# EAGLE design smartstickSTM32f103cb (EAGLE 6.5.0)
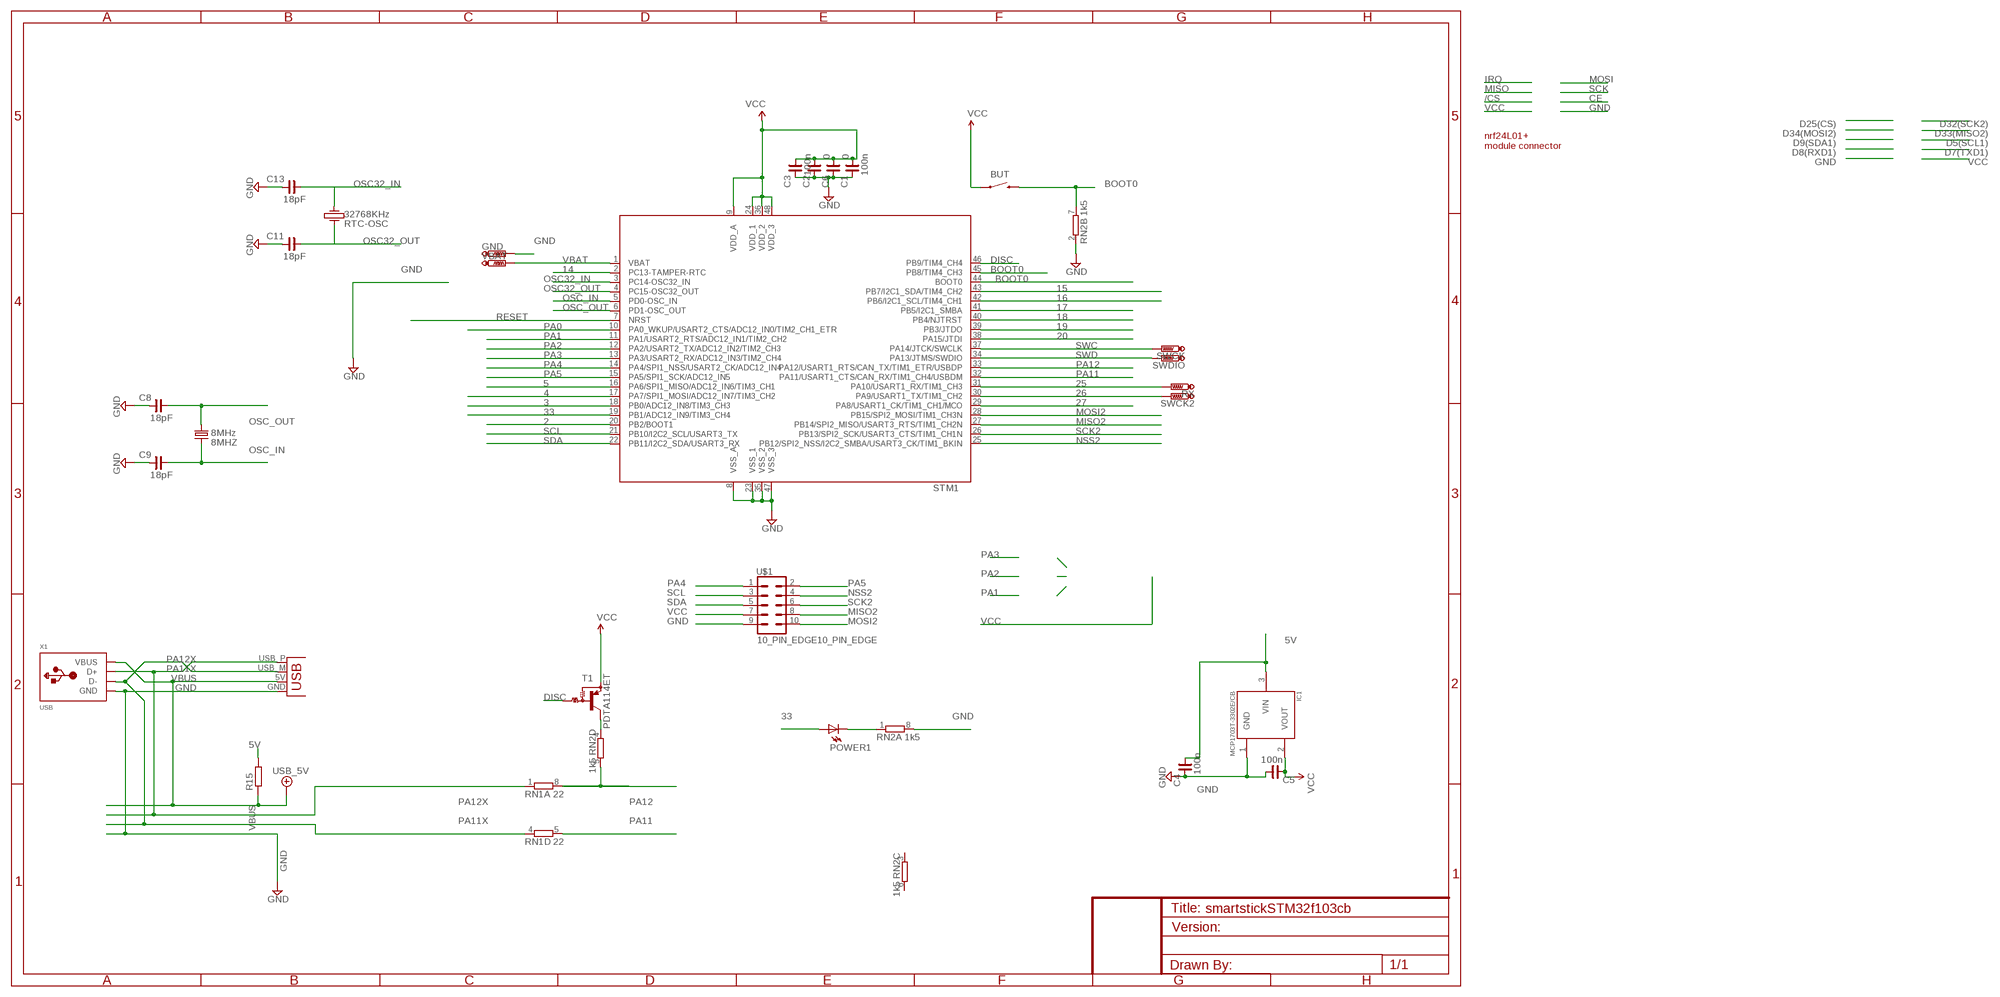
[diagram p0: schematic, sheet 1]

## Parts
8MHZ  8MHz  CRYSTALHC49US  [HC49US]
BUT  SWITCH-MOMENTARY-2-SMD-1101NE  [TACTILE-SWITCH-1101NE]
C1  100n  C_0603  [C0603]
C2  0  C_0603  [C0603]
C3  100n  C_0603  [C0603]
C4  100n  C_0603  [C0603]
C5  100n  C_0603  [C0603]
C6  0  C_0603  [C0603]
C8  18pF  C_0603  [C0603]
C9  18pF  C_0603  [C0603]
C11  18pF  C_0603  [C0603]
C13  18pF  C_0603  [C0603]
GND  PTR1TP20SQ  [TP20SQ]
IC1  MCP1703T-3302E/CB  MCP1700T  [SOT23]
POWER1  Power  LED0603  [LED-0603]
R15  R-EU_R0603  [R0603]
RN1  22  4R-N0603-ARC  [0603-ARC]
RN2  1k5  4R-N0603-ARC  [0603-ARC]
RTC-OSC  32768KHz  CRYSTALL  [KX-327LT]
RX  PTR1TP10R  [TP10R]
STM1  STM32F103CB  [LQFP48]
SWCK  PTR1TP16R  [TP16R]
SWCK2  PTR1TP10R  [TP10R]
SWDIO  PTR1TP16R  [TP16R]
T1  PDTA114ET  ES_PNP-DRIVERSOT23-3  [ES_SOT23-3]
U$1  10_PIN_EDGE10_PIN_EDGE  [10_PIN_EDGE]
VBAT  PTR1TP19R  [TP19R]
X1  USB  [MOLEX-48037-1000]
X3  USBPCB  [USB-A-PCB]

## Nets
2: STM1.20(PB2/BOOT1)
3: STM1.18(PB0/ADC12_IN8/TIM3_CH3)
4: STM1.17(PA7/SPI1_MOSI/ADC12_IN7/TIM3_CH2)
5: STM1.16(PA6/SPI1_MISO/ADC12_IN6/TIM3_CH1)
5V [vcc]: C4.1 IC1.3(VIN) R15.2
14: STM1.2(PC13-TAMPER-RTC)
15: STM1.43(PB7/I2C1_SDA/TIM4_CH2)
16: STM1.42(PB6/I2C1_SCL/TIM4_CH1)
17: STM1.41(PB5/I2C1_SMBA)
18: STM1.40(PB4/NJTRST)
19: STM1.39(PB3/JTDO)
20: STM1.38(PA15/JTDI)
25: RX.TP STM1.31(PA10/USART1_RX/TIM1_CH3)
26: STM1.30(PA9/USART1_TX/TIM1_CH2) SWCK2.TP
27: STM1.29(PA8/USART1_CK/TIM1_CH1/MCO)
33: POWER1.A STM1.19(PB1/ADC12_IN9/TIM3_CH4)
BOOT0: BUT.P$2 RN2.7 STM1.44(BOOT0) STM1.45(PB8/TIM4_CH3)
DISC: STM1.46(PB9/TIM4_CH4) T1.1(B)
GND [vcc]: C1.2 C2.2 C3.2 C4.2 C5.1 C6.2 C8.2 C9.2 C11.2 C13.2 GND.TP IC1.1(GND) RN2.2 RN2.8 STM1.8(VSS_A) STM1.23(VSS_1) STM1.35(VSS_2) STM1.47(VSS_3) U$1.9 X1.4(GND) X3.GND
MISO2: STM1.27(PB14/SPI2_MISO/USART3_RTS/TIM1_CH2N) U$1.8
MOSI2: STM1.28(PB15/SPI2_MOSI/TIM1_CH3N) U$1.10
N$5: POWER1.C RN2.1
N$51: RN2.4 T1.3(C)
NSS2: STM1.25(PB12/SPI2_NSS/I2C2_SMBA/USART3_CK/TIM1_BKIN) U$1.4
OSC32_IN: C13.1 RTC-OSC.1 STM1.3(PC14-OSC32_IN)
OSC32_OUT: C11.1 RTC-OSC.4 STM1.4(PC15-OSC32_OUT)
OSC_IN: 8MHZ.2 C9.1 STM1.5(PD0-OSC_IN)
OSC_OUT: 8MHZ.1 C8.1 STM1.6(PD1-OSC_OUT)
PA0: STM1.10(PA0_WKUP/USART2_CTS/ADC12_IN0/TIM2_CH1_ETR)
PA1: STM1.11(PA1/USART2_RTS/ADC12_IN1/TIM2_CH2)
PA2: STM1.12(PA2/USART2_TX/ADC12_IN2/TIM2_CH3)
PA3: STM1.13(PA3/USART2_RX/ADC12_IN3/TIM2_CH4)
PA4: STM1.14(PA4/SPI1_NSS/USART2_CK/ADC12_IN4) U$1.1
PA5: STM1.15(PA5/SPI1_SCK/ADC12_IN5) U$1.2
PA11: RN1.5 STM1.32(PA11/USART1_CTS/CAN_RX/TIM1_CH4/USBDM)
PA11X: RN1.4 X1.2(D-) X3.USB_M(D-)
PA12: RN1.8 RN2.5 STM1.33(PA12/USART1_RTS/CAN_TX/TIM1_ETR/USBDP)
PA12X: RN1.1 X1.3(D+) X3.USB_P(D+)
RESET: STM1.7(NRST)
SCK2: STM1.26(PB13/SPI2_SCK/USART3_CTS/TIM1_CH1N) U$1.6
SCL: STM1.21(PB10/I2C2_SCL/USART3_TX) U$1.3
SDA: STM1.22(PB11/I2C2_SDA/USART3_RX) U$1.5
SWC: STM1.37(PA14/JTCK/SWCLK) SWCK.TP
SWD: STM1.34(PA13/JTMS/SWDIO) SWDIO.TP
VBAT: STM1.1(VBAT) VBAT.TP
VBUS: R15.1 X1.1(VBUS) X3.5V(VBUS) ; supply symbol labelled USB_5V
VCC [vcc]: BUT.P$1 C1.1 C2.1 C3.1 C5.2 C6.1 IC1.2(VOUT) STM1.9(VDD_A) STM1.24(VDD_1) STM1.36(VDD_2) STM1.48(VDD_3) T1.2(E) U$1.7
Unconnected: RN1.2 RN1.3 RN1.6 RN1.7 RN2.3 RN2.6

## Notes on the sheet
- nrf24L01+ 
  module connector
- BOOT0

## Library data of the parts
8MHZ = SparkFun_20110922_my:CRYSTAL: Crystals Various standard crystals. Proven footprints. Spark Fun Electronics SKU : COM-00534
BUT = SparkFun:SWITCH-MOMENTARY-2
C1-C6 C8 C9 C11 C13 = rc-master-smd:C_: NON-POLARIZED CAP
GND RX SWCK SWCK2 SWDIO VBAT = testpad:PTR1: TEST PIN
IC1 = okie:MCP1700T
POWER1 = SparkFun:LED: LEDs Standard schematic elements and footprints for 5mm, 3mm, 1206, and 0603 sized LEDs. 5mm - Spark Fun Electronics SKU : COM-00529 (and others)
R15 = resistor:R-EU_: RESISTOR, European symbol
RN1 RN2 = resistor-dil:4R-N: Array Chip Resistor Source: RS Component / Phycomp; OC_FARNELL: unknown; OC_NEWARK: unknown
RTC-OSC = es:CRYSTALL
STM1 = stm32:STM32F103CB
T1 = pnp_digital_transistor:ES_PNP-DRIVER
U$1 = eclibrary:10_PIN_EDGE
X1 = todstuff:USB
X3 = SparkFun:USB: USB Connectors USB-B-PTH is fully proven SKU : PRT-00139 USB-miniB is fully proven SKU : PRT-00587 USB-A-PCB is untested. USB-A-H is throughly reviewed, but untested. Spark Fun Electronics SKU : PRT-00437 USB-B-SMT is throughly reviewed, but untested. Needs silkscreen touching up. USB-A-S has not been used/tested USB-MB-H has not been used/tested

## Net classes
0 default: width 0.152 mm, drill 0.356 mm, clearance 0.152 mm
1 vcc: width 0.152 mm, drill 0.356 mm, clearance 0.152 mm
2 pwr: width 0.152 mm, drill 0.356 mm, clearance 0.152 mm

## Board
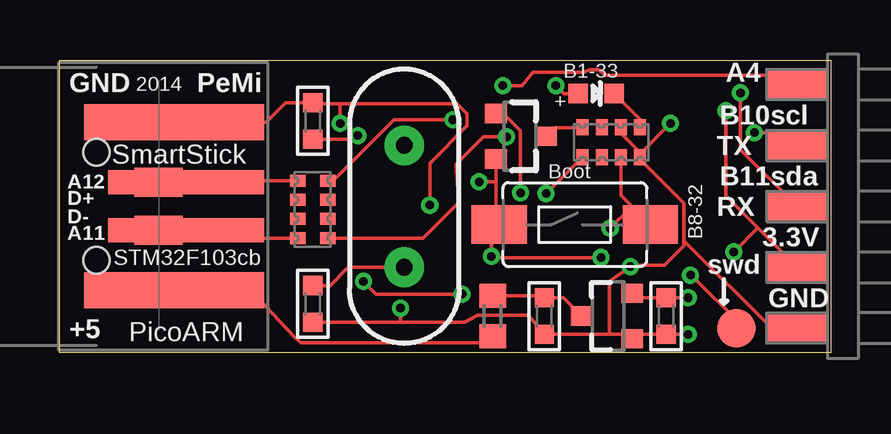
[diagram p1: board, top side]
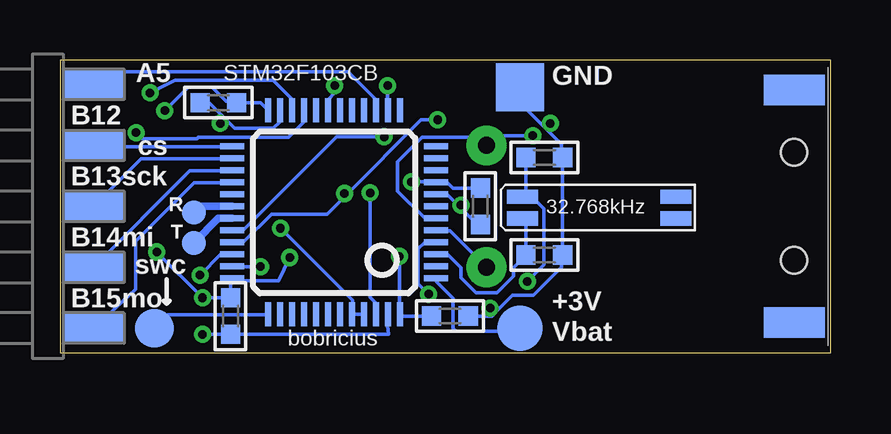
[diagram p2: board, bottom side, seen from below]

Size 32.13 x 12.19 mm. Coordinates in mm from the lower left corner, seen from the top.
Outline: 0,12.19 32.13,12.19 32.13,0 0,0 0,12.19
Copper layers (1*16): Top 0.0356mm / dielectric 1.5011mm / Bottom 0.0356mm
Design rules "LaenPCBOrder *": minimum track width 6mil, minimum drill 13mil, track to track 6mil, track to pad 6mil, pad to pad 6mil, via to via 6mil, smd to smd 6mil, copper to edge 15mil, drill to drill 6mil, minimum pad ring 7mil, minimum via ring 7mil, stop-mask expansion 3mil, vias tented up to drill 100mil, thermal gap 10mil
tRestrict: area 0.1,0.8 to 3.2,11.7
vRestrict: area 0.1,0.8 to 8,11.7

### Footprints (pad centres in the part's own frame; a part is rotated, then mirrored left to right if it is on the bottom)
HC49US = drill 0.7 pad 1.651: 1 -2.54,0; 2 2.54,0
TACTILE-SWITCH-1101NE = smd 2.3 x 1.6: P$1 -3.15,0; P$2 3.15,0
C0603 = smd 0.8 x 0.8: 1 -0.762,0; 2 0.762,0
TP20SQ = smd 2 x 2: TP 0,0
SOT23 = smd 0.8 x 0.9: 1 -0.95,-1; 2 0.95,-1; 3 0,1.1
LED-0603 = smd 0.8 x 0.8: A 0,-0.75; C 0,0.75
R0603 = smd 1 x 1.1: 1 -0.85,0; 2 0.85,0
0603-ARC = smd 0.5 x 0.65: 1 -1.2,-0.625; 2 -0.4,-0.625; 3 0.4,-0.625; 4 1.2,-0.625; 5 1.2,0.625; 6 0.4,0.625; 7 -0.4,0.625; 8 -1.2,0.625
KX-327LT = smd 1.3 x 0.6: 1 -3.2,-0.5; 2 3.2,-0.5; 3 3.2,0.4; 4 -3.2,0.4
TP10R = smd 1 x 1: TP 0,0
LQFP48 = smd 0.254 x 1: 1 -2.75,-4.25; 2 -2.25,-4.25; 3 -1.75,-4.25; 4 -1.25,-4.25; 5 -0.75,-4.25; 6 -0.25,-4.25; 7 0.25,-4.25; 8 0.75,-4.25; 9 1.25,-4.25; 10 1.75,-4.25; 11 2.25,-4.25; 12 2.75,-4.25; 25 2.75,4.25; 26 2.25,4.25; 27 1.75,4.25; 28 1.25,4.25; 29 0.75,4.25; 30 0.25,4.25; 31 -0.25,4.25; 32 -0.75,4.25; 33 -1.25,4.25; 34 -1.75,4.25; 35 -2.25,4.25; 36 -2.75,4.25 | smd 1 x 0.254: 13 4.25,-2.75; 14 4.25,-2.25; 15 4.25,-1.75; 16 4.25,-1.25; 17 4.25,-0.75; 18 4.25,-0.25; 19 4.25,0.25; 20 4.25,0.75; 21 4.25,1.25; 22 4.25,1.75; 23 4.25,2.25; 24 4.25,2.75; 37 -4.25,2.75; 38 -4.25,2.25; 39 -4.25,1.75; 40 -4.25,1.25; 41 -4.25,0.75; 42 -4.25,0.25; 43 -4.25,-0.25; 44 -4.25,-0.75; 45 -4.25,-1.25; 46 -4.25,-1.75; 47 -4.25,-2.25; 48 -4.25,-2.75
TP16R = smd 1.6 x 1.6: TP 0,0
ES_SOT23-3 = smd 0.8 x 0.9: 1 -0.95,-1; 2 0.95,-1; 3 0,1.1
10_PIN_EDGE = smd 1.27 x 2.54: 1 5.08,0; 3 2.54,0; 5 0,0; 7 -2.54,0; 9 -5.08,0 | smd 1.27 x 2.54 bottom: 2 5.08,0; 4 2.54,0; 6 0,0; 8 -2.54,0; 10 -5.08,0
TP19R = smd 1.9 x 1.9: TP 0,0
MOLEX-48037-1000 = smd 2 x 1.2: 1 2.6,-3.5; 2 2.6,-1; 3 2.6,1; 4 2.6,3.5 | smd 2.54 x 1.27 bottom: P$1 0,4.85; P$2 0,-4.85 | hole 1.1: 0,2.25; 0,-2.25
USB-A-PCB = smd 7.5 x 1.5: 5V -0.2,-3.5; GND -0.2,3.5 | smd 6.5 x 1: USB_M 0.3,-1; USB_P 0.3,1

### Placement (x,y rotation side)
8MHZ  14.35,6.1 270 top
BUT  21.46,5.33 0 top
C1  25.02,1.52 270 bottom
C2  15.88,1.52 0 bottom
C3  14.61,6.1 270 bottom
C4  20.19,1.52 270 top
C5  25.53,10.41 0 bottom
C6  25.27,1.52 270 top
C8  10.54,9.65 90 top
C9  10.54,2.03 270 top
C11  11.94,8.13 0 bottom
C13  11.94,4.06 0 bottom
GND  12.95,11.05 0 bottom
IC1  22.86,1.52 90 top
POWER1  22.35,10.8 270 top
R15  18.03,1.52 90 top
RN1  10.54,5.97 270 top
RN2  22.99,8.76 180 top
RTC-OSC  9.65,6.1 0 bottom
RX  26.54,4.57 0 bottom
STM1  20.7,5.84 90 bottom
SWCK  28.19,1.02 0 bottom
SWCK2  26.54,5.84 0 bottom
SWDIO  28.19,1.02 270 top
T1  19.18,9.02 270 top
U$1  30.73,6.1 90 top
VBAT  12.95,1.02 0 bottom
X1  1.52,6.1 0 top
X3  4.95,6.1 0 top

### Tracks (layer width: path | path; a pad name or v marks a point on that pad's centre or on a via)
5V
  Top 0.152: IC1.3 21.74,1.52 20.98,2.29 C4.1 20.12,2.36 18.03,2.36 R15.2
25
  Bottom 0.305: STM1.31 25.53,5.59 RX.TP
26
  Bottom 0.305: STM1.30 26.54,6.09 SWCK2.TP
33  (via drill 0.36)
  Top 0.152: POWER1.A 21.01,10.8 v20.68,11.12
  Bottom 0.152: v20.68,11.12 20.68,10.82 20.93,10.57 20.93,10.11 STM1.19
BOOT0  (via drill 0.36)
  Top 0.152: BUT.P$2 23.39,6.55 RN2.7 | BUT.P$2 | v22.94,5.18 23.8,6.05 BUT.P$2
  Bottom 0.152: STM1.45 19.94,1.6 STM1.44 19.94,1.68 19.94,2.18 v22.94,5.18
DISC  (via drill 0.36)
  Top 0.152: v19.2,6.66 19.2,9.25 18.49,9.96 18.19,9.96 T1.1
  Bottom 0.152: v19.2,6.66 19.2,2.31 18.97,2.08 18.97,1.6 STM1.46
GND  (via drill 0.36)
  Top 0.152: v15.42,6.15 15.42,7.9 16.97,9.45 16.97,9.96 16.56,10.36 11.68,10.36 | 11.68,10.36 10.59,10.36 C8.2 9.4,10.41 8.59,9.6 X3.GND X1.4 | RN2.8 24.18,8.15 24.18,8.36 23.39,9.14 RN2.2 | 22.91,0.76 23.67,0.76 23.85,0.58 IC1.1 23.77,0.76 C6.2 v26.19,0.76 | 22.91,0.76 C4.2 19.53,1.55 17.4,1.55 16.87,1.27 14.2,1.27 | 14.2,1.27 C9.2 | 22.91,0.76 22.91,2.97 v23.77,3.58 23.82,3.63 25.2,3.63 26.01,4.45 26.01,4.62 | 26.01,4.62 26.01,6.22 24.23,8 24.23,8.08 RN2.8 | v25.45,9.55 24.23,8.33 RN2.8 | U$1.9 29.67,1.02 26.06,4.62 26.01,4.62 | 14.2,1.27 v14.2,1.85 | v11.68,9.55 11.68,10.36
  Bottom 0.152: C3.2 14.73,5.33 15.47,6.07 | 15.47,6.07 15.98,6.58 16.43,6.58 STM1.8 | v15.42,6.15 15.42,6.12 15.47,6.07 | C2.2 14.12,1.52 14,1.65 | 14,1.65 13.26,2.39 12.39,2.39 11.23,3.56 11.23,4.01 C13.2 C11.2 11.23,8.18 11.23,8.69 11.89,9.35 | GND.TP 12.95,10.41 11.89,9.35 | STM1.47 18.47,1.57 18.47,1.12 18.44,0.76 C1.2 v26.19,0.76 | C5.1 25.91,10.41 25.25,9.75 | 25.25,9.75 24.84,9.35 23.24,9.35 22.96,9.63 STM1.23 | v23.77,3.58 24.94,3.58 STM1.35 | v25.45,9.55 25.25,9.75 | v14.2,1.85 14,1.65 | 11.89,9.35 v11.68,9.55
MISO2
  Bottom 0.152: U$1.8 26.72,7.57 24.97,7.57 STM1.27
MOSI2
  Bottom 0.152: U$1.10 28.98,2.64 28.98,4.65 26.54,7.09 24.97,7.09 STM1.28
N$5
  Top 0.152: RN2.1 24.18,9.4 24.18,9.73 POWER1.C
N$51
  Top 0.152: RN2.4 21.77,9.37 20.65,9.37 20.29,9.02 T1.3
NSS2
  Bottom 0.152: U$1.4 30.68,8.59 24.97,8.59 STM1.25
OSC32_IN
  Bottom 0.152: RTC-OSC.1 12.83,5.59 12.7,5.46 C13.1 13.23,3.53 13.23,3.18 13.92,2.49 14.78,2.49 15.42,3.12 15.42,3.53 15.98,4.09 16.43,4.09 STM1.3
OSC32_OUT  (via drill 0.36)
  Top 0.152: v16.76,2.44 13.18,2.44 v12.65,2.97
  Bottom 0.152: C11.1 12.7,6.63 12.83,6.5 RTC-OSC.4 12.65,6.68 11.96,5.99 11.96,3.66 v12.65,2.97 | v16.76,2.44 17.2,2.87 17.2,4.32 16.94,4.57 16.46,4.57 STM1.4
OSC_IN
  Top 0.152: C9.1 11.25,2.79 12.01,3.56 8MHZ.2
  Bottom 0.152: 8MHZ.2 15.88,5.08 16.43,5.08 STM1.5
OSC_OUT  (via drill 0.36)
  Top 0.152: C8.1 12.27,8.89 v12.42,9.04
  Bottom 0.152: v12.42,9.04 13.95,9.04 8MHZ.1 14.12,8.97 17.04,8.97 18.06,7.95 18.06,6.73 16.94,5.61 16.46,5.61 STM1.6
PA4  (via drill 0.36)
  Top 0.152: v18.47,11.12 19.25,11.12 19.71,11.68 21.84,11.68 22.07,11.79 22.45,11.79 22.73,11.56 30.12,11.56
  Top 0.254: U$1.1 30.12,11.18 30.12,11.56
  Bottom 0.152: v18.47,11.12 18.47,10.11 STM1.14
PA5
  Bottom 0.152: U$1.2 30.2,11.71 20.12,11.71 18.97,10.57 18.97,10.11 STM1.15
PA11  (via drill 0.36)
  Top 0.152: v18.62,8.99 17.65,8.99 16.51,7.85 16.64,6.27 15.14,4.77 11.18,4.77 RN1.5
  Bottom 0.152: v18.62,8.99 20.6,8.99 24.49,5.11 STM1.32
PA11X
  Top 0.152: RN1.4 5.56,4.77 5.26,5.08 X3.USB_M 5.18,5.11 4.14,5.11 X1.2
PA12  (via drill 0.36)
  Top 0.152: v16.38,9.7 13.92,9.7 11.41,7.19 11.18,7.19 RN1.8 | v20.27,6.63 21.77,8.13 RN2.5
  Bottom 0.152: v16.38,9.7 17.07,9.7 20.19,6.58 | 20.19,6.58 21.01,5.77 23.32,5.77 24.49,4.6 STM1.33 | v20.27,6.63 20.24,6.63 20.19,6.58
PA12X
  Top 0.152: RN1.1 5.31,7.16 5.26,7.11 X3.USB_P 5.18,7.09 4.14,7.09 X1.3
SCK2
  Bottom 0.152: U$1.6 28.75,8.08 24.97,8.08 STM1.26
SCL  (via drill 0.36)
  Top 0.152: v28.96,9.17 30.2,9.17 U$1.3
  Bottom 0.152: v28.96,9.17 28.7,8.91 26.42,8.91 26.36,8.97 22.61,8.97 21.97,9.6 21.97,10.08 STM1.21
SDA  (via drill 0.36)
  Top 0.152: v28.37,10.82 28.37,8.46 U$1.5
  Bottom 0.152: v28.37,10.82 27.33,11.35 23.24,11.35 22.45,10.57 22.45,10.11 STM1.22
SWC
  Bottom 0.152: SWCK.TP 27.63,1.57 23.47,1.57 STM1.37
SWD  (via drill 0.36)
  Top 0.152: v26.29,3.23 26.42,3.15 28.32,1.25 SWDIO.TP
  Bottom 0.152: v26.29,3.23 25.43,4.09 24.97,4.09 STM1.34
VBAT
  Bottom 0.152: STM1.1 16.43,3.02 16.43,2.95 15.75,2.26 15.75,1.02 15.62,0.89 13.08,0.89 VBAT.TP
VBUS
  Top 0.152: 7.95,2.59 9.78,0.64 10.06,0.41 18.03,0.41 R15.1 | 7.95,2.59 X1.1 | 7.95,2.59 X3.5V
VCC  (via drill 0.36)
  Top 0.152: 18.19,7.11 18.19,5.44 18.29,5.33 BUT.P$1 18.24,5.28 17.98,5.03 v17.98,4.01 18.03,3.96 v22.55,3.96 | 18.19,7.11 18.19,8.05 T1.2 | 18.19,7.11 v17.48,7.11 | IC1.2 23.88,2.46 24.05,2.29 C6.1 v26.19,2.29 | v27.76,10.08 27.76,6.53 29.1,5.19 | U$1.7 29.1,5.19 | 29.1,5.19 v28.09,4.19
  Bottom 0.152: C3.1 15.75,6.86 15.98,7.09 16.43,7.09 STM1.9 16.51,7.11 v17.48,7.11 | C2.1 17.88,1.52 17.93,1.57 STM1.48 17.98,1.65 v17.98,4.01 | STM1.24 23.47,10.11 23.77,10.41 C5.2 24.82,10.46 25.2,10.46 25.78,11.05 26.8,11.05 v27.76,10.08 | v28.09,4.19 v26.19,2.29 C1.1 25.02,3.02 24.97,3.07 STM1.36 24.94,3 23.01,3 v22.55,3.96

### Text on the board
tNames: B1-33 | A4 | GND | 2014 | PeMi | + | B10scl | TX | SmartStick | Boot | A12 | D+ | B11sda | D- | RX | A11 | B8-32 | 3.3V | STM32F103cb | swd | GND | +5 | PicoARM
bNames: STM32F103CB | A5 | GND | B12 | cs | R | B13sck | 32.768kHz | T | B14mi | swc | +3V | B15mo | Vbat | bobricius